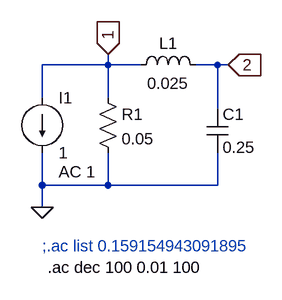
[diagram p0: schematic test_14.asc]
test_14.asc, the LTspice schematic file:
Version 4
SHEET 1 880 680
WIRE 64 48 64 32
WIRE 64 48 -32 48
WIRE 112 48 64 48
WIRE 224 48 192 48
WIRE 240 48 224 48
WIRE -32 96 -32 48
WIRE 64 96 64 48
WIRE 224 112 224 48
WIRE -32 224 -32 176
WIRE 64 224 64 176
WIRE 64 224 -32 224
WIRE 224 224 224 176
WIRE 224 224 64 224
WIRE -32 256 -32 224
FLAG -32 256 0
FLAG 64 32 1
IOPIN 64 32 In
FLAG 240 48 2
IOPIN 240 48 In
SYMBOL current -32 96 R0
WINDOW 123 24 108 Left 2
WINDOW 39 0 0 Left 0
SYMATTR Value2 AC 1
SYMATTR InstName I1
SYMATTR Value 1
SYMBOL res 48 80 R0
SYMATTR InstName R1
SYMATTR Value 0.05
SYMBOL ind 96 64 R270
WINDOW 0 32 56 VTop 2
WINDOW 3 5 56 VBottom 2
SYMATTR InstName L1
SYMATTR Value 0.025
SYMBOL cap 208 112 R0
SYMATTR InstName C1
SYMATTR Value 0.25
TEXT -32 312 Left 2 ;;.ac list 0.159154943091895
TEXT -24 344 Left 2 !.ac dec 100 0.01 100

The netlist it stands for:
* test_14.asc
I1 1 0 1 AC 1
R1 1 0 0.05
L1 1 2 0.025
C1 2 0 0.25
* ;.ac list 0.159154943091895
.ac dec 100 0.01 100
.backanno
.end